# EAGLE design amp01 (EAGLE 6.1)
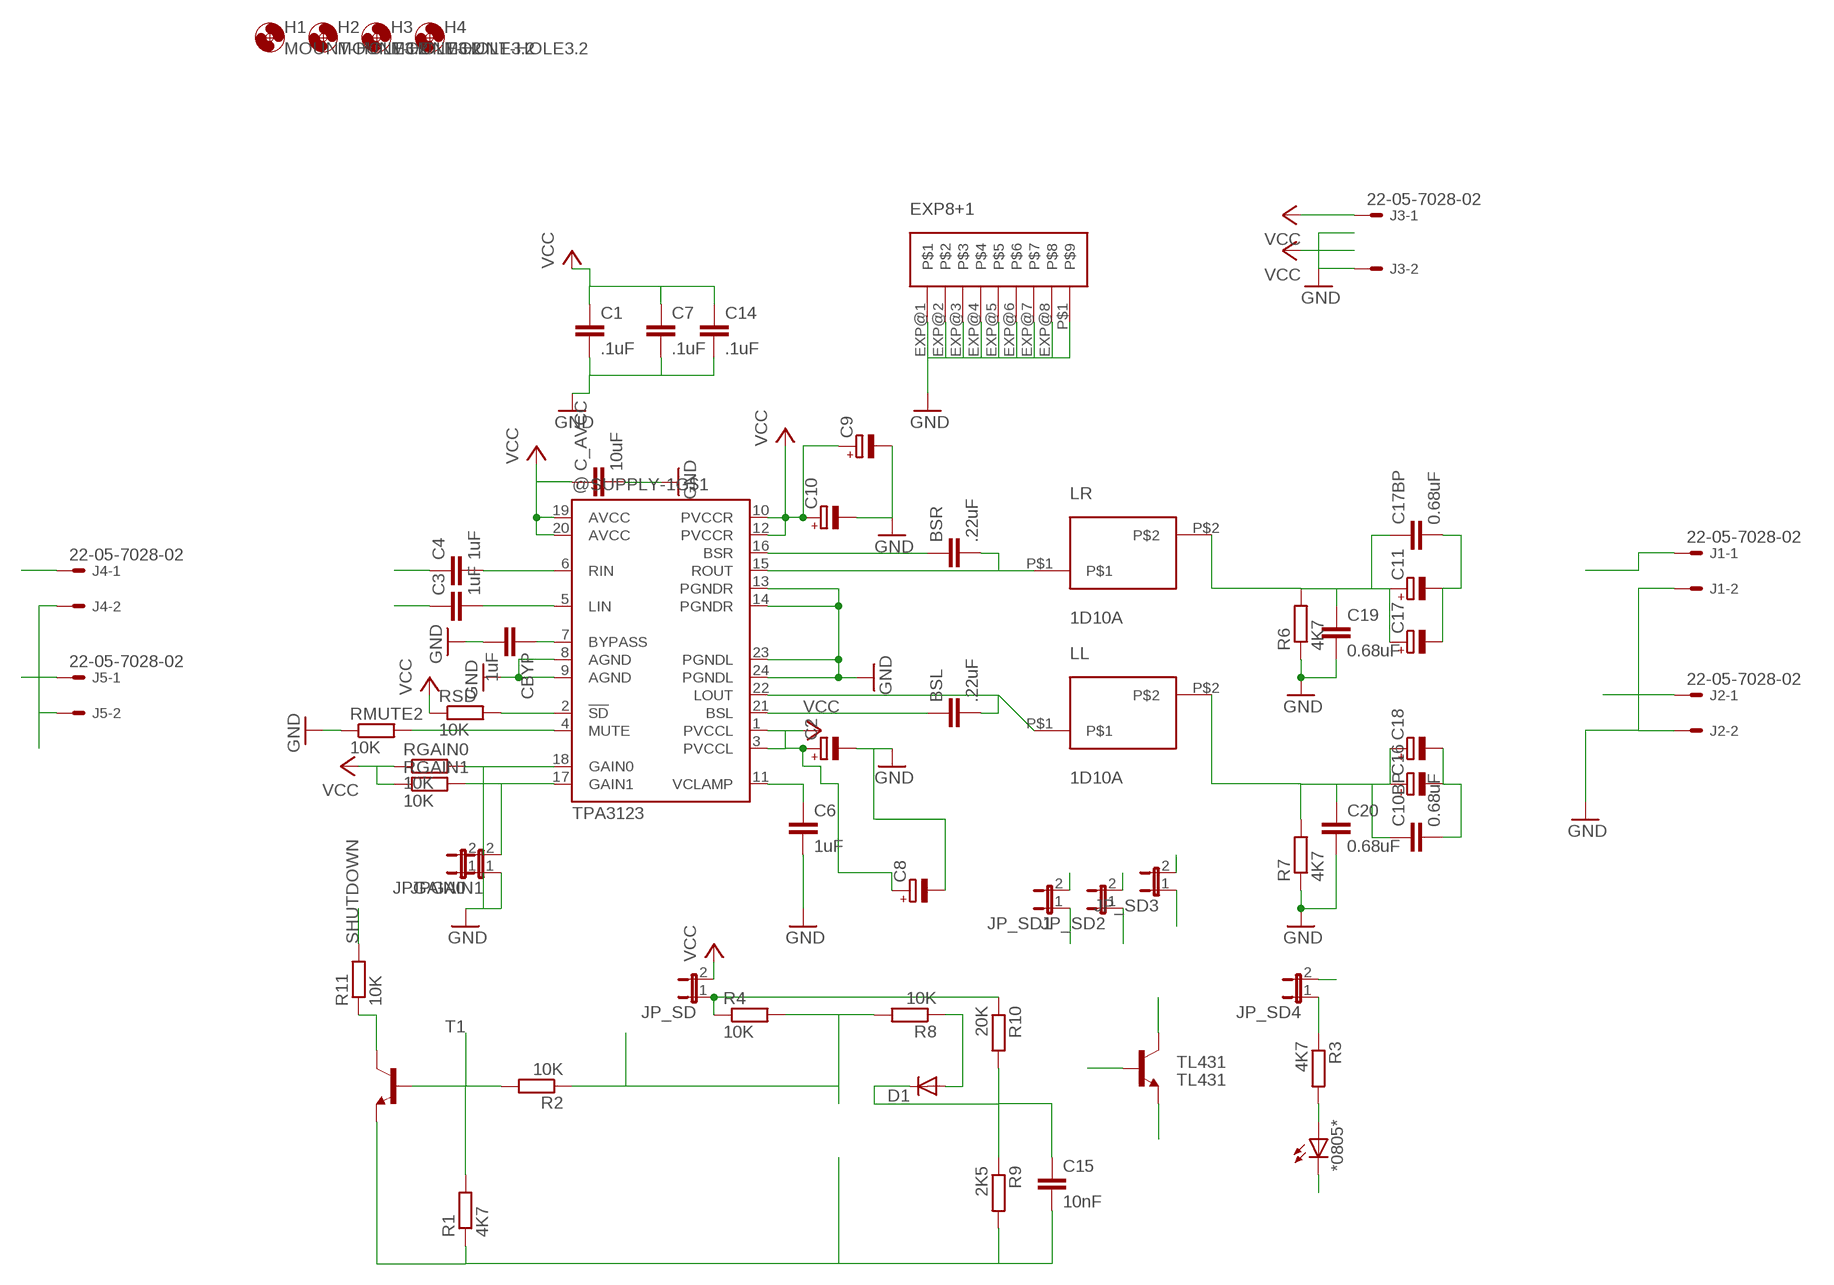
[diagram p0: schematic, sheet 1]

## Parts
*0805*  LEDCHIP-LED0805  [CHIP-LED0805]
@SUPPLY-1  TPA3123  [PWP-TSSOP24]
BSL  .22uF  C-EUC0805  [C0805]
BSR  .22uF  C-EUC0805  [C0805]
C1  .1uF  C-EUC0805  [C0805]
C2  CPOL-EUF  [PANASONIC_F]
C3  1uF  C-EU050-050X075  [C050-050X075]
C4  1uF  C-EU050-050X075  [C050-050X075]
C6  1uF  C-EUC0805  [C0805]
C7  .1uF  C-EUC0805  [C0805]
C8  CPOL-EUF  [PANASONIC_F]
C9  CPOL-EUF  [PANASONIC_F]
C10  CPOL-EUF  [PANASONIC_F]
C10BP  0.68uF  C-EU050-055X075  [C050-055X075]
C11  CPOL-EUF  [PANASONIC_F]
C14  .1uF  C-EUC0805  [C0805]
C15  10nF  C-EUC0805  [C0805]
C16  CPOL-EUF  [PANASONIC_F]
C17  CPOL-EUF  [PANASONIC_F]
C17BP  0.68uF  C-EU050-055X075  [C050-055X075]
C18  CPOL-EUF  [PANASONIC_F]
C19  0.68uF  C-EU050-055X075  [C050-055X075]
C20  0.68uF  C-EU050-055X075  [C050-055X075]
C_AVCC  10uF  C-EUC1210  [C1210]
CBYP  1uF  C-EUC0805  [C0805]
D1  DIODE-MICROMELF-W  [MICROMELF-W]
H1  MOUNT-HOLE3.2  [3,2]
H2  MOUNT-HOLE3.2  [3,2]
H3  MOUNT-HOLE3.2  [3,2]
H4  MOUNT-HOLE3.2  [3,2]
J1  22-05-7028-02  [7395-02]
J2  22-05-7028-02  [7395-02]
J3  22-05-7028-02  [7395-02]
J4  22-05-7028-02  [7395-02]
J5  22-05-7028-02  [7395-02]
JP_SD  JUMPER-2SMD-NC  [SJ_2S]
JP_SD1  JUMPER-2SMD-NC  [SJ_2S]
JP_SD2  JUMPER-2SMD-NC  [SJ_2S]
JP_SD3  JUMPER-2SMD-NC  [SJ_2S]
JP_SD4  JUMPER-2SMD-NC  [SJ_2S]
JPGAIN0  JUMPER-2SMD-NC  [SJ_2S]
JPGAIN1  JUMPER-2SMD-NC  [SJ_2S]
LL  1D10A  [1D10APAC]
LR  1D10A  [1D10APAC]
R1  4K7  R-EU_R0805  [R0805]
R2  10K  R-EU_R0805  [R0805]
R3  4K7  R-EU_R0805  [R0805]
R4  10K  R-EU_R0805  [R0805]
R6  4K7  R-EU_R0805  [R0805]
R7  4K7  R-EU_R0805  [R0805]
R8  10K  R-EU_R0805  [R0805]
R9  2K5  R-EU_R0805  [R0805]
R10  20K  R-EU_R0805  [R0805]
R11  10K  R-EU_R0805  [R0805]
RGAIN0  10K  R-EU_R0805  [R0805]
RGAIN1  10K  R-EU_R0805  [R0805]
RMUTE2  10K  R-EU_R0805  [R0805]
RSD  10K  R-EU_R0805  [R0805]
T1  MMBT3904LT1-NPN-SOT23-BEC  [SOT23-BEC]
TL431  TL431  TRANSISTOR_NPNMMBT2222A  [SOT23]

## Nets
GND: *0805*.C @SUPPLY-1.8(AGND) @SUPPLY-1.9(AGND) @SUPPLY-1.13(PGNDR) @SUPPLY-1.14(PGNDR) @SUPPLY-1.23(PGNDL) @SUPPLY-1.24(PGNDL) @SUPPLY-1.EXP@1 @SUPPLY-1.EXP@2 @SUPPLY-1.EXP@3 @SUPPLY-1.EXP@4 @SUPPLY-1.EXP@5 @SUPPLY-1.EXP@6 @SUPPLY-1.EXP@7 @SUPPLY-1.EXP@8 @SUPPLY-1.P$1 C1.2 C2.- C6.2 C7.2 C8.- C9.- C10.- C14.2 C15.2 C19.2 C20.2 C_AVCC.2 CBYP.2 J1.2 J2.2 J3.2 J4.2 J5.2 JP_SD1.1 JP_SD2.1 JP_SD3.1 JPGAIN0.1 JPGAIN1.1 R1.1 R6.1 R7.1 R9.2 RMUTE2.1 T1.E TL431.3(C)
GND1: JP_SD1.2
GND2: JP_SD2.2 JP_SD3.2
K: R2.1 R4.2 R8.2 TL431.1(B)
LOUT: C11.- C17.- C17BP.2 J1.1
N$1: @SUPPLY-1.6(RIN) C4.2
N$2: @SUPPLY-1.5(LIN) C3.2
N$3: C3.1 J5.1
N$4: JP_SD.1 R4.1 R10.1
N$5: @SUPPLY-1.11(VCLAMP) C6.1
N$6: @SUPPLY-1.4(MUTE) RMUTE2.2
N$7: @SUPPLY-1.18(GAIN0) JPGAIN0.2 RGAIN0.2
N$8: @SUPPLY-1.17(GAIN1) JPGAIN1.2 RGAIN1.2
N$9: C4.1 J4.1
N$10: @SUPPLY-1.15(ROUT) BSR.2 LR.P$1
N$11: @SUPPLY-1.16(BSR) BSR.1
N$12: @SUPPLY-1.22(LOUT) BSL.2 LL.P$1
N$13: @SUPPLY-1.21(BSL) BSL.1
N$14: C10BP.1 C16.+ C18.+ C20.1 LL.P$2 R7.2
N$15: R1.2 R2.2 T1.B
N$16: *0805*.A R3.2
N$17: C11.+ C17.+ C17BP.1 C19.1 LR.P$2 R6.2
N$19: JP_SD4.1 R3.1
N$21: R11.1 T1.C
N$23: D1.A R8.1
REF: C15.1 D1.C R9.1 R10.2 TL431.2(E)
ROUT: C10BP.2 C16.- C18.- J2.1
SHUTDOWN: @SUPPLY-1.2(!SD) R11.2 RSD.2
VBYP: @SUPPLY-1.7(BYPASS) CBYP.1
VCC: @SUPPLY-1.1(PVCCL) @SUPPLY-1.3(PVCCL) @SUPPLY-1.10(PVCCR) @SUPPLY-1.12(PVCCR) @SUPPLY-1.19(AVCC) @SUPPLY-1.20(AVCC) C1.1 C2.+ C7.1 C8.+ C9.+ C10.+ C14.1 C_AVCC.1 J3.1 JP_SD4.2 JP_SD.2 RGAIN0.1 RGAIN1.1 RSD.1

## Library data of the parts
*0805* = adafruit:LED: LED OSRAM: - CHIPLED LG R971, LG N971, LY N971, LG Q971, LY Q971, LO R971, LY R971 LH N974, LH R974 LS Q976, LO Q976, LY Q976 LO Q996 - Hyper CHIPLED LW Q18S LB Q993, LB Q99A, LB R99A - SideLED LS A670, LO A670, LY A670, LG A670, LP A670 LB A673, LV A673, LT A673, LW A673 LH A674 LY A675 LS A676, LA A676, LO A676, LY A676, LW A676 LS A679, LY A679, LG A679 - Hyper Micro SIDELED® LS Y876, LA Y876, LO Y876, LY Y876 LT Y87S - SmartLED LW L88C, LW L88S LB L89C, LB L89S, LG L890 LS L89K, LO L89K, LY L89K LS L896, LA L896, LO L896, LY L896 - TOPLED LS T670, LO T670, LY T670, LG T670, LP T670 LSG T670, LSP T670, LSY T670, LOP T670, LYG T670 LG T671, LOG T671, LSG T671 LB T673, LV T673, LT T673, LW T673 LH T674 LS T676, LA T676, LO T676, LY T676, LB T676, LH T676, LSB T676, LW T676 LB T67C, LV T67C, LT T67C, LS T67K, LO T67K, LY T67K, LW E67C LS E67B, LA E67B, LO E67B, LY E67B, LB E67C, LV E67C, LT E67C LW T67C LS T679, LY T679, LG T679 LS T770, LO T770, LY T770, LG T770, LP T770 LB T773, LV T773, LT T773, LW T773 LH T774 LS E675, LA E675, LY E675, LS T675 LS T776, LA T776, LO T776, LY T776, LB T776 LHGB T686 LT T68C, LB T68C - Hyper Mini TOPLED® LB M676 - Mini TOPLED Santana® LG M470 LS M47K, LO M47K, LY M47K Source: http://www.osram.convergy.de/
@SUPPLY-1 = texas:TPA3123
BSL BSR C1 C3 C4 C6 C7 C10BP C14 C15 C17BP C19 C20 C_AVCC CBYP = rcl:C-EU: CAPACITOR, European symbol
C2 C8-C11 C16-C18 = rcl:CPOL-EU: POLARIZED CAPACITOR, European symbol
D1 = diode:DIODE-: DIODE
H1-H4 = holes:MOUNT-HOLE: MOUNTING HOLE with drill center marker
J1-J5 = con-molex:22-?-02: CONNECTOR wire to board 2.54 mm (.1 inch) pitch header; OC_FARNELL: 9731601; OC_NEWARK: unknown
JP_SD JP_SD1-JP_SD4 JPGAIN0 JPGAIN1 = SparkFun-Passives:JUMPER-2: Jumper Basic 0.1" spaced jumper. Use with breakaway headers.
LL LR = wes:1D10A
R1-R4 R6-R11 RGAIN0 RGAIN1 RMUTE2 RSD = rcl:R-EU_: RESISTOR, European symbol
T1 = transistor:*-NPN-: NPN Transistror BF959 corrected 2008.03.06
TL431 = SparkFun-DiscreteSemi:TRANSISTOR_NPN: Generic NPN BJT MMBT2222A - TRANS-08049 (SOT-23, 1A 40V) MPSA42 - TRANS-09116 (SOT-23, 500mA 300V) MMBT5088LT1G - TRANS-11160 (SOT-23, 50 mA 30V); PROD_ID: TRANS-08049; VALUE: MMBT2222A

## Board
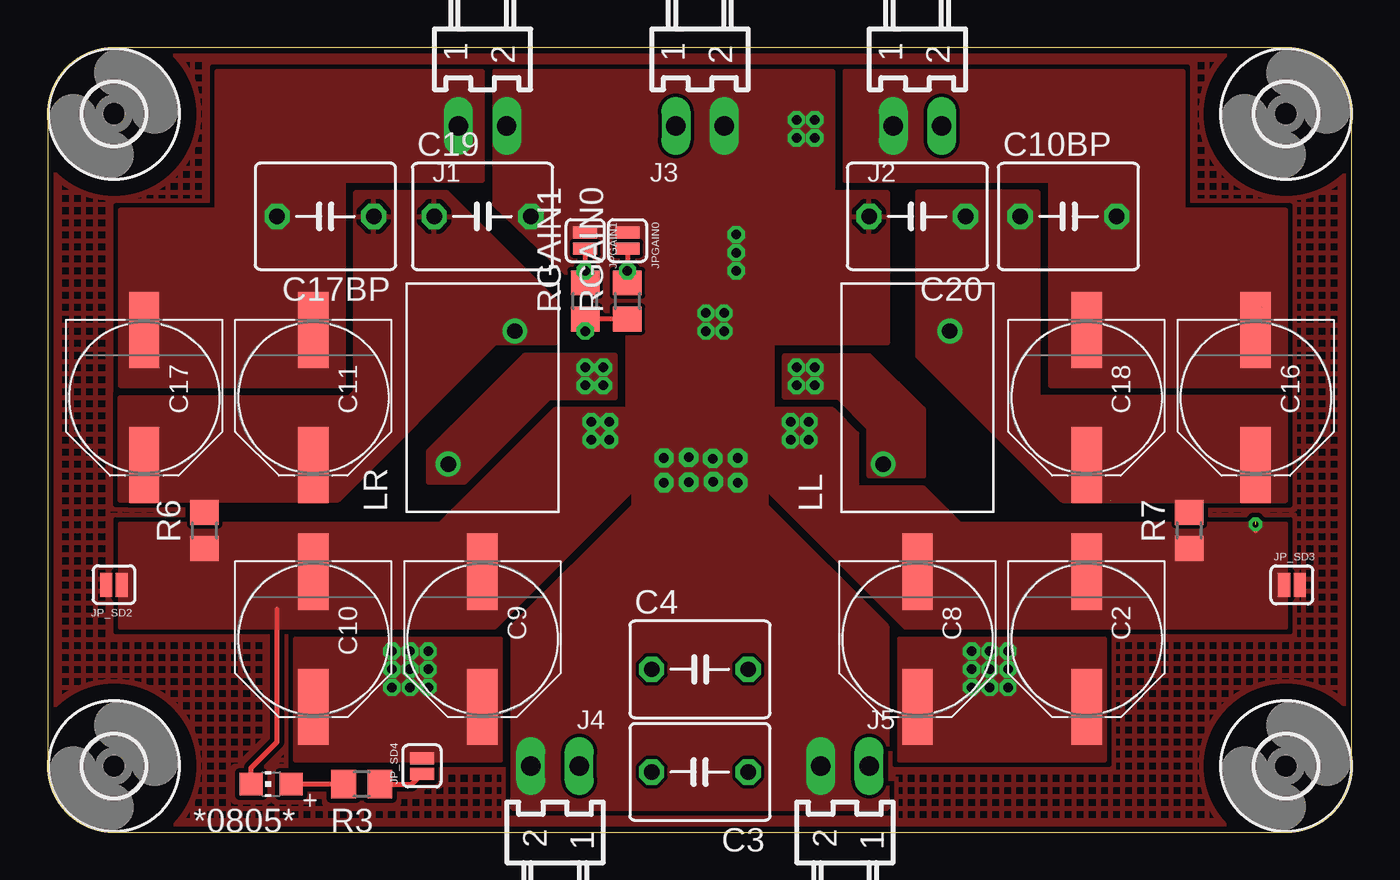
[diagram p1: board, top side]
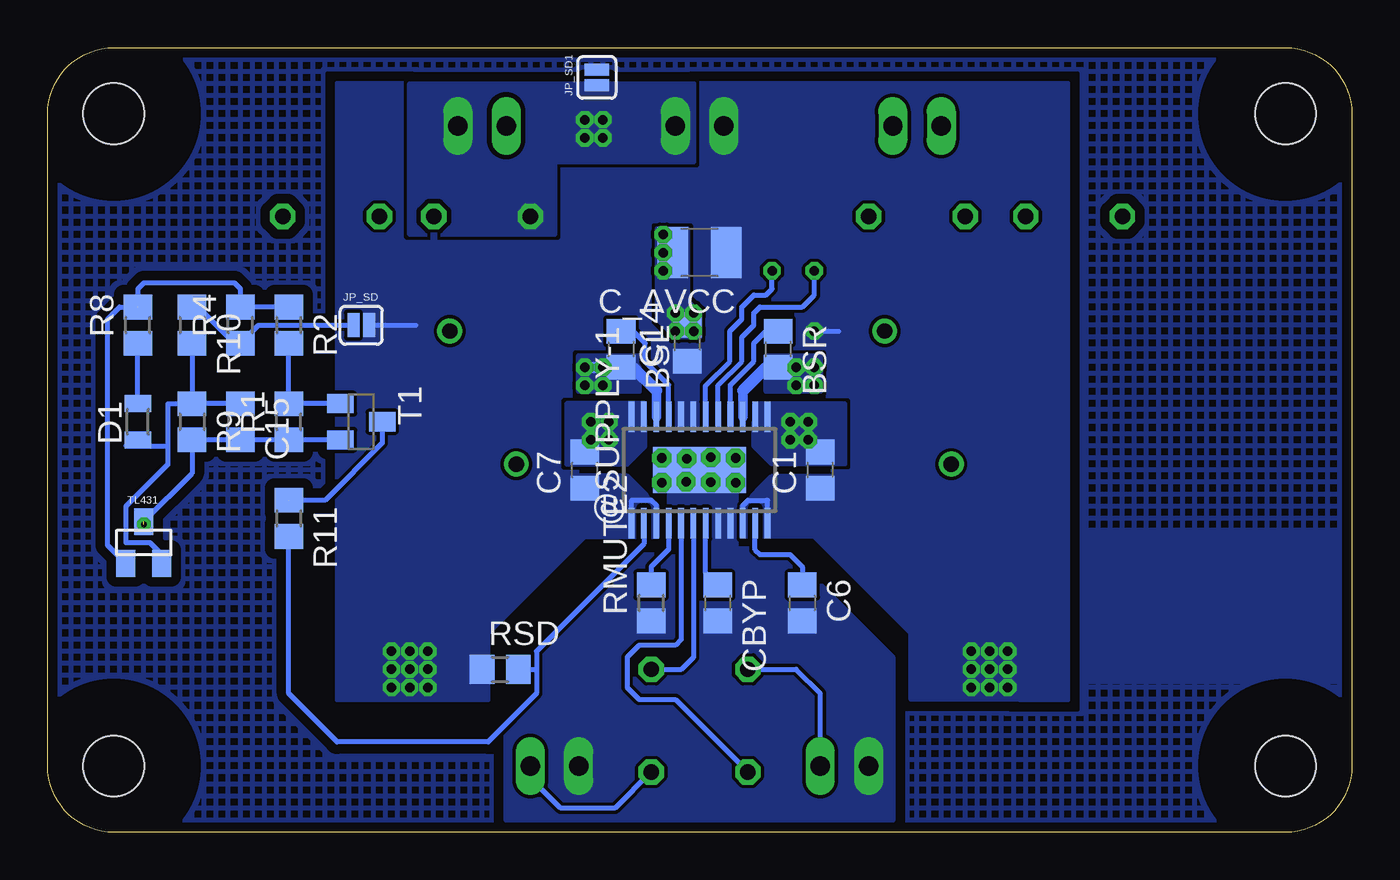
[diagram p2: board, bottom side, seen from below]

Size 68.56 x 41.26 mm. Coordinates in mm from the lower left corner, seen from the top.
Outline: 0,37.77 0,3.49 arc90 3.49,0 65.07,0 arc90 68.56,3.49 68.56,37.77 arc90 65.07,41.26 3.49,41.26 arc90 0,37.77
Copper layers (1*16): Top 0.035mm / dielectric 1.5mm / Bottom 0.035mm
Design rules: minimum track width 10mil, minimum drill 0.3mm, track to track 7mil, track to pad 7mil, pad to pad 7mil, via to via 7mil, smd to smd 0mil, copper to edge 12mil, drill to drill 8mil, minimum pad ring 10mil, minimum via ring 8mil, stop-mask expansion 4mil, vias tented up to drill 0mil, thermal gap 10mil

### Footprints (pad centres in the part's own frame; a part is rotated, then mirrored left to right if it is on the bottom)
CHIP-LED0805 = smd 1.2 x 1.2: A 0,-1.05; C 0,1.05
PWP-TSSOP24 = smd 1.6 x 0.3: 1 -2.8,3.575; 2 -2.8,2.925; 3 -2.8,2.275; 4 -2.8,1.625; 5 -2.8,0.975; 6 -2.8,0.325; 7 -2.8,-0.325; 8 -2.8,-0.975; 9 -2.8,-1.625; 10 -2.8,-2.275; 11 -2.8,-2.925; 12 -2.8,-3.575; 13 2.8,-3.575; 14 2.8,-2.925; 15 2.8,-2.275; 16 2.8,-1.625; 17 2.8,-0.975; 18 2.8,-0.325; 19 2.8,0.325; 20 2.8,0.975; 21 2.8,1.625; 22 2.8,2.275; 23 2.8,2.925; 24 2.8,3.575 | drill 0.5 pad 1.016 octagon: EXP@1 -0.665,1.98; EXP@2 0.635,1.98; EXP@3 -0.605,0.71; EXP@4 0.605,0.68; EXP@5 -0.635,-0.59; EXP@6 0.665,-0.59; EXP@7 -0.665,-1.89; EXP@8 0.635,-1.89 | smd 2.4 x 4.87: P$1 0,0
C0805 = smd 1.3 x 1.5: 1 -0.95,0; 2 0.95,0
PANASONIC_F = smd 4 x 1.6: + 3.55,0; - -3.55,0
C050-050X075 = drill 0.813 octagon: 1 -2.54,0; 2 2.54,0
C050-055X075 = drill 0.813 octagon: 1 -2.54,0; 2 2.54,0
C1210 = smd 1.6 x 2.7: 1 -1.4,0; 2 1.4,0
MICROMELF-W = smd 0.9 x 1.4: A 0.95,0; C -0.95,0
3,2 = hole 3.2: 0,0
7395-02 = drill 1.016 long: 1 1.27,0; 2 -1.27,0
SJ_2S = smd 0.635 x 1.27: 1 -0.412,0; 2 0.412,0
1D10APAC = drill 0.8: P$1 -3.5,1.8; P$2 3.5,-1.7
R0805 = smd 1.3 x 1.5: 1 -0.95,0; 2 0.95,0
SOT23-BEC = smd 1 x 1.4: B -0.95,-1.1; C 0,1.1; E 0.95,-1.1
SOT23 = smd 1 x 1.4: 1 -0.95,-1.1; 2 0.95,-1.1; 3 0,1.1

### Placement (x,y rotation side)
*0805*  11.75,2.54 90 top
@SUPPLY-1  34.29,19.05 90 bottom
BSL  38.42,25.4 270 bottom
BSR  30.16,25.4 270 bottom
C1  27.94,19.05 90 bottom
C2  54.61,10.16 270 top
C3  34.29,3.17 180 top
C4  34.29,8.57 0 top
C6  28.89,12.06 270 bottom
C7  40.32,19.05 90 bottom
C8  45.72,10.16 270 top
C9  22.86,10.16 270 top
C10  13.97,10.16 270 top
C10BP  53.66,32.38 0 top
C11  13.97,22.86 270 top
C14  34.92,25.72 90 bottom
C15  58.42,21.59 270 bottom
C16  63.5,22.86 270 top
C17  5.08,22.86 270 top
C17BP  14.61,32.38 180 top
C18  54.61,22.86 270 top
C19  22.86,32.38 0 top
C20  45.72,32.38 180 top
C_AVCC  34.29,30.48 180 bottom
CBYP  33.34,12.06 270 bottom
D1  63.82,21.59 90 bottom
H1  3.49,37.78 0 top
H2  3.49,3.49 0 top
H3  65.09,3.49 0 top
H4  65.09,37.78 0 top
J1  22.86,37.15 180 top
J2  45.72,37.15 180 top
J3  34.29,37.15 180 top
J4  26.67,3.49 0 top
J5  41.91,3.49 0 top
JP_SD  52.07,26.67 0 bottom
JP_SD1  39.69,39.69 90 bottom
JP_SD2  3.49,13.02 180 top
JP_SD3  65.41,13.02 0 top
JP_SD4  19.68,3.49 90 top
JPGAIN0  30.48,31.11 270 top
JPGAIN1  28.26,31.11 270 top
LL  45.72,22.86 90 top
LR  22.86,22.86 90 top
R1  55.88,21.59 90 bottom
R2  55.88,26.67 270 bottom
R3  16.51,2.54 180 top
R4  58.42,26.67 90 bottom
R6  8.26,15.88 90 top
R7  60.01,15.88 90 top
R8  63.82,26.67 90 bottom
R9  60.96,21.59 270 bottom
R10  60.96,26.67 270 bottom
R11  55.88,16.51 270 bottom
RGAIN0  30.48,27.94 90 top
RGAIN1  28.26,27.94 90 top
RMUTE2  36.83,12.06 90 bottom
RSD  44.77,8.57 0 bottom
T1  52.07,21.59 270 bottom
TL431  63.5,15.24 0 bottom

### Tracks (layer width: path | path; a pad name or v marks a point on that pad's centre or on a via)
GND  (via drill 0.3, 0.5)  (1 unrouted)
  Top 0.254: v63.5,16.19 63.5,15.88 | *0805*.C 10.7,3.4 12.06,4.76 12.06,11.75
  Bottom 0.254: T1.E R1.1 C15.2 R9.2 60.96,18.88 TL431.3
  other vias: 39.05,21.59 40.01,21.59 39.05,20.64 40.01,20.64 29.53,21.59 28.57,21.59 28.57,20.64 29.53,20.64 35.56,27.3 34.61,27.3 35.56,26.35 34.61,26.35 36.2,29.53 36.2,30.48 36.2,31.43 40.32,37.47 39.37,37.47 40.32,36.51 39.37,36.51
  pour Bottom (isolate 0.254, no thermals): 31.43,20.32 31.43,22.54 26.67,22.54 26.67,19.37 30.48,19.37
  pour Bottom (isolate 0.254, no thermals): 41.27,22.54 41.27,19.37 38.1,19.37 37.15,20.32 37.15,22.54
  pour Top (no thermals): 3.81,16.19 3.81,10.79 23.5,10.79 31.11,18.41 31.11,22.23 26.67,22.23 20.64,16.19
  pour Top (no thermals): 37.47,22.23 37.47,18.41 45.09,10.79 65.09,10.79 65.09,16.19 47.94,16.19 46.04,18.1 42.55,18.1 42.55,20.95 41.27,22.23
  pour Top (no thermals): 24.45,1.27 44.13,1.27 44.13,10.79 37.78,17.14 37.78,22.23 38.1,22.23 38.1,26.67 41.27,28.89 41.27,40.01 23.5,40.01 23.5,33.02 30.48,26.35 30.48,22.23 30.8,22.23 30.8,17.14 24.45,10.79
  pour Bottom (no thermals): 32.38,18.41 32.38,14.92 29.84,14.92 24.13,9.21 24.13,0.64 44.45,0.64 44.45,9.21 39.05,14.61 35.88,14.61 35.88,18.41
  pour Bottom (isolate 0.254, no thermals): 34.92,31.75 34.92,27.94 34.29,27.3 34.29,26.04 35.56,26.04 36.51,26.99 36.51,31.75
  pour Top: 38.1,33.66 44.13,33.66 44.13,25.72 37.78,25.72 37.78,33.34
  pour Bottom (isolate 0.254, no thermals): 49.53,39.37 34.61,39.37 34.61,35.24 41.91,35.24 41.91,31.43 49.53,31.43
GND1
  pour Bottom (isolate 0.508, rank 5, no thermals, hatched): -3.17,44.45 -3.17,-3.17 73.03,-3.17 73.03,44.45
  pour Bottom (isolate 0.508, rank 4, no thermals): 0.64,15.88 13.97,15.88 13.97,7.94 0.64,7.94
GND2
  pour Top (isolate 0.254, rank 6, no thermals, hatched): 3.49,41.27 65.09,41.27 arc-90 68.58,37.78 68.58,3.81 arc-90 65.09,0.32 3.49,0.32 arc-90 0,3.81 0,37.78 arc-90
K  (1 unrouted)
  Bottom 0.254: R2.1 R4.2 58.42,28.57 58.74,28.89 63.5,28.89 63.82,28.57 R8.2 64.77,27.62 65.41,26.99 65.41,15.1 TL431.1
LOUT
  pour Top (no thermals): 3.81,23.5 15.56,23.5 15.56,34.29 22.86,34.29 22.86,40.01 8.89,40.01 8.89,32.7 3.81,32.7
N$1
  Bottom 0.254: C4.2 35.24,8.57 34.61,9.21 34.62,9.21 @SUPPLY-1.6
N$2
  Bottom 0.254: @SUPPLY-1.5 35.27,10.14 35.56,9.84 37.47,9.84 38.1,9.21 38.1,7.62 37.47,6.99 35.56,6.99 C3.2
N$3
  Bottom 0.254: C3.1 38.73,1.27 41.59,1.27 43.18,2.86 J5.1
N$4
  Bottom 0.254: R10.1 60.96,27.94 58.74,25.72 R4.1 57.47,26.67 JP_SD.1
N$5
  Bottom 0.254: 29.21,12.7 C6.1 28.89,13.97 29.53,14.61 31.11,14.61 31.36,14.86 @SUPPLY-1.11
N$6
  Bottom 0.254: @SUPPLY-1.4 35.91,14.88 36.83,13.97 RMUTE2.2
N$7  (via drill 0.5)
  Top 0.254: JPGAIN0.2 v30.48,29.53 RGAIN0.2
  Bottom 0.254: @SUPPLY-1.18 33.97,23.5 32.7,24.77 32.7,26.35 32.07,26.99 32.07,27.62 31.43,28.26 30.8,28.26 30.48,28.57 v30.48,29.53
N$8  (via drill 0.5)
  Top 0.254: JPGAIN1.2 v28.26,29.53 RGAIN1.2
  Bottom 0.254: @SUPPLY-1.17 33.31,23.52 32.07,24.77 32.07,26.04 31.43,26.67 31.43,27.3 31.11,27.62 28.89,27.62 28.26,28.26 v28.26,29.53
N$9
  Bottom 0.254: J4.1 27.94,7.3 29.21,8.57 C4.1
N$10  (via drill 0.5)
  Bottom 0.254: BSR.2
  Bottom 0.508: @SUPPLY-1.15 32.02,23.23
  Bottom 0.61: 32.02,23.23 30.8,24.45 BSR.2
  other vias: 28.26,23.5 29.21,23.5 28.26,24.45 29.21,24.45
  pour Top (no thermals): 29.84,25.08 25.08,25.08 20,20 20,18.41 21.91,18.41 26.35,22.86 29.84,22.86
  pour Bottom (no thermals): 30.8,25.08 27.94,25.08 27.94,23.18 30.8,23.18
N$11
  Bottom 0.254: @SUPPLY-1.16 32.66,23.53 31.43,24.77 31.43,25.72 30.8,26.35 BSR.1
N$12  (via drill 0.5)
  Bottom 0.254: BSL.2
  Bottom 0.508: @SUPPLY-1.22 36.56,23.23
  Bottom 0.61: 36.56,23.23 37.78,24.45 v40.32,24.45 BSL.2
  other vias: 39.37,24.45 39.37,23.5 40.32,23.5
  pour Bottom (no thermals): 37.47,25.08 37.47,23.18 40.64,23.18 40.64,25.08
  pour Top (no thermals): 38.73,25.08 43.18,25.08 46.04,22.23 46.04,18.73 43.18,18.73 43.18,21.27 41.59,22.86 38.73,22.86
N$13
  Bottom 0.254: @SUPPLY-1.21 35.91,23.53 37.15,24.77 37.15,25.72 37.78,26.35 BSL.1
N$14
  pour Top (no thermals): 45.72,33.66 45.72,25.08 53.34,17.46 65.09,17.46 65.09,22.86 52.07,22.86 52.07,33.66
N$15
  Bottom 0.254: T1.B R1.2 R2.2
N$16
  Top 0.254: R3.2 *0805*.A
N$17
  pour Top (no thermals): 26.67,27.94 26.67,25.72 23.5,25.72 15.24,17.46 3.81,17.46 3.81,22.86 15.88,22.86 20.95,27.94
  pour Top: 16.19,33.66 20.95,33.66 26.67,27.94 22.86,27.3 16.51,20.95 16.19,21.27
N$19
  Top 0.254: R3.1 19.14,2.54 JP_SD4.1
N$21  (1 unrouted)
  Bottom 0.254: 50.8,21.59 T1.C 50.97,20.47 53.98,17.46 R11.1
N$23
  Bottom 0.254: D1.A R8.1
REF
  Bottom 0.254: R10.2 R9.1 | C15.1 R9.1 | 62.23,20.32 62.23,22.54 R9.1 | D1.C 64.45,20.32 62.23,20.32 | TL431.2 62.55,14.6 63.18,15.24 64.45,15.24 64.45,17.14 62.23,19.37 62.23,20.32
ROUT
  pour Top (no thermals): 65.09,23.5 65.09,32.7 59.69,32.7 59.69,40.01 41.91,40.01 41.91,34.29 52.7,34.29 52.7,23.5
SHUTDOWN
  Bottom 0.254: @SUPPLY-1.2 37.22,15.17 42.86,9.53 42.86,8.57 | 42.86,8.57 42.86,7.3 45.4,4.76 53.34,4.76 55.88,7.3 R11.2 | RSD.2 42.86,8.57
VBYP
  Bottom 0.254: CBYP.1 33.02,12.7 33.97,13.64 @SUPPLY-1.7
VCC  (via drill 0.5)
  Top 0.254: RGAIN0.1 RGAIN1.1 v28.26,26.35
  Bottom 0.254: @SUPPLY-1.1 37.87,17.46 | @SUPPLY-1.12 30.71,17.46 | @SUPPLY-1.10 32.02,17.2 31.75,17.46 30.8,17.46 | @SUPPLY-1.3 36.56,17.2 36.83,17.46 37.78,17.46 | v28.26,26.35 26.99,26.35 | JP_SD.2 49.21,26.67
  other vias: 18.1,9.53 19.05,9.53 20,9.53 20,8.57 19.05,8.57 18.1,8.57 18.1,7.62 19.05,7.62 20,7.62 48.58,9.53 49.53,9.53 50.48,9.53 50.48,8.57 49.53,8.57 48.58,8.57 48.58,7.62 49.53,7.62 50.48,7.62
  pour Bottom (no thermals): 35.56,21.27 33.97,21.27 33.97,25.4 35.88,25.4 35.88,23.81
  pour Top (no thermals): 13.02,10.16 13.02,3.81 23.81,3.81 23.81,10.16
  pour Top (no thermals): 44.77,10.16 44.77,3.81 55.56,3.81 55.56,10.16
  pour Bottom (isolate 0.254, no thermals): 32.07,15.56 32.07,17.14 30.48,18.73 23.5,18.73 17.46,12.38 17.46,6.99 23.18,6.99 23.18,10.48 28.26,15.56
  pour Bottom (isolate 0.254, no thermals): 36.51,15.56 36.51,17.14 38.1,18.73 45.09,18.73 53.34,12.38 53.34,6.99 45.4,6.99 45.4,10.48 40.32,15.56
  pour Bottom (rank 4, no thermals): 33.66,39.37 35.88,25.4 35.88,24.13 35.24,23.5 34.61,23.5 24.77,17.46 17.46,6.99 14.92,6.99 14.92,39.37
  pour Bottom (rank 2, no thermals): 33.02,39.37 53.34,39.37 53.34,11.43 48.26,11.43 33.02,26.67